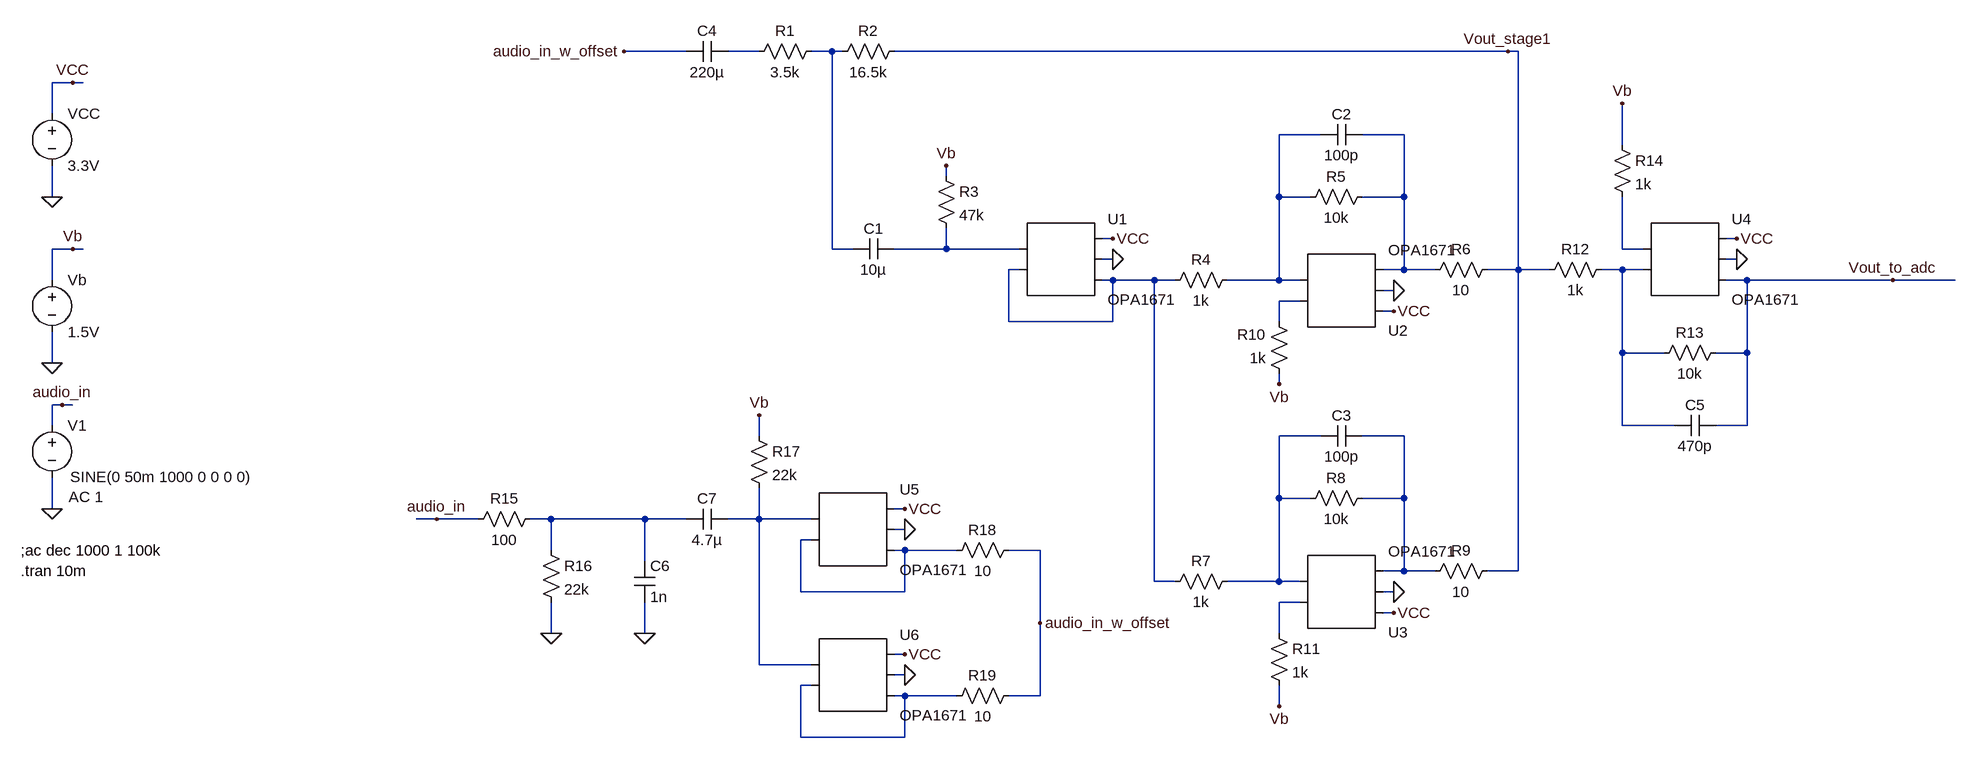
[diagram p0: schematic octaver.asc]
octaver.asc, the LTspice schematic file:
Version 4
SHEET 1 3124 1676
WIRE 144 592 48 592
WIRE 256 592 208 592
WIRE 368 592 336 592
WIRE 384 592 368 592
WIRE 1408 592 464 592
WIRE 1424 592 1408 592
WIRE -800 640 -832 640
WIRE -784 640 -800 640
WIRE -832 688 -832 640
WIRE 1120 720 1056 720
WIRE 1248 720 1184 720
WIRE 1584 736 1584 672
WIRE 544 784 544 768
WIRE -832 816 -832 768
WIRE 1056 816 1056 720
WIRE 1104 816 1056 816
WIRE 1248 816 1248 720
WIRE 1248 816 1184 816
WIRE 800 880 784 880
WIRE 1760 880 1744 880
WIRE -800 896 -832 896
WIRE -784 896 -800 896
WIRE 368 896 368 592
WIRE 400 896 368 896
WIRE 544 896 544 864
WIRE 544 896 464 896
WIRE 656 896 544 896
WIRE 1584 896 1584 816
WIRE 1616 896 1584 896
WIRE 800 912 784 912
WIRE 1760 912 1744 912
WIRE 656 928 640 928
WIRE 1248 928 1248 816
WIRE 1248 928 1216 928
WIRE 1296 928 1248 928
WIRE 1424 928 1424 592
WIRE 1424 928 1376 928
WIRE 1472 928 1424 928
WIRE 1584 928 1552 928
WIRE 1616 928 1584 928
WIRE -832 944 -832 896
WIRE 800 944 784 944
WIRE 864 944 800 944
WIRE 896 944 864 944
WIRE 1056 944 1056 816
WIRE 1056 944 976 944
WIRE 1088 944 1056 944
WIRE 1776 944 1744 944
WIRE 2000 944 1776 944
WIRE 2096 944 2000 944
WIRE 1232 960 1216 960
WIRE 1088 976 1056 976
WIRE 1232 992 1216 992
WIRE 640 1008 640 928
WIRE 800 1008 800 944
WIRE 800 1008 640 1008
WIRE 1056 1008 1056 976
WIRE 1584 1056 1584 928
WIRE 1648 1056 1584 1056
WIRE 1776 1056 1776 944
WIRE 1776 1056 1728 1056
WIRE -832 1072 -832 1024
WIRE 1056 1104 1056 1088
WIRE -816 1136 -832 1136
WIRE -800 1136 -816 1136
WIRE -832 1168 -832 1136
WIRE 1584 1168 1584 1056
WIRE 1664 1168 1584 1168
WIRE 1776 1168 1776 1056
WIRE 1776 1168 1728 1168
WIRE 256 1184 256 1152
WIRE 1120 1184 1056 1184
WIRE 1248 1184 1184 1184
WIRE 1056 1280 1056 1184
WIRE 1104 1280 1056 1280
WIRE 1248 1280 1248 1184
WIRE 1248 1280 1184 1280
WIRE -832 1296 -832 1248
WIRE 480 1296 464 1296
WIRE -240 1312 -272 1312
WIRE -176 1312 -240 1312
WIRE -64 1312 -96 1312
WIRE 80 1312 -64 1312
WIRE 144 1312 80 1312
WIRE 256 1312 256 1264
WIRE 256 1312 208 1312
WIRE 336 1312 256 1312
WIRE 480 1328 464 1328
WIRE 336 1344 320 1344
WIRE -64 1360 -64 1312
WIRE 480 1360 464 1360
WIRE 560 1360 480 1360
WIRE 688 1360 640 1360
WIRE 80 1376 80 1312
WIRE 1248 1392 1248 1280
WIRE 1248 1392 1216 1392
WIRE 1296 1392 1248 1392
WIRE 1424 1392 1424 928
WIRE 1424 1392 1376 1392
WIRE 864 1408 864 944
WIRE 896 1408 864 1408
WIRE 1056 1408 1056 1280
WIRE 1056 1408 976 1408
WIRE 1088 1408 1056 1408
WIRE 320 1424 320 1344
WIRE 480 1424 480 1360
WIRE 480 1424 320 1424
WIRE 1232 1424 1216 1424
WIRE 1088 1440 1056 1440
WIRE 1232 1456 1216 1456
WIRE 688 1472 688 1360
WIRE -64 1488 -64 1440
WIRE 80 1488 80 1440
WIRE 1056 1488 1056 1440
WIRE 480 1520 464 1520
WIRE 256 1536 256 1312
WIRE 336 1536 256 1536
WIRE 480 1552 464 1552
WIRE 336 1568 320 1568
WIRE 480 1584 464 1584
WIRE 560 1584 480 1584
WIRE 688 1584 688 1472
WIRE 688 1584 640 1584
WIRE 1056 1600 1056 1568
WIRE 320 1648 320 1568
WIRE 480 1648 480 1584
WIRE 480 1648 320 1648
FLAG -832 1296 0
FLAG -816 1136 audio_in
FLAG -832 816 0
FLAG -800 640 VCC
FLAG -832 1072 0
FLAG -800 896 Vb
FLAG 800 912 0
FLAG 800 880 VCC
FLAG 1232 960 0
FLAG 1232 992 VCC
FLAG 2000 944 Vout_to_adc
FLAG 1232 1424 0
FLAG 1232 1456 VCC
FLAG 544 768 Vb
FLAG 1056 1104 Vb
FLAG 1056 1600 Vb
FLAG 1760 912 0
FLAG 1760 880 VCC
FLAG 1584 672 Vb
FLAG 1408 592 Vout_stage1
FLAG -64 1488 0
FLAG 80 1488 0
FLAG 256 1152 Vb
FLAG 480 1328 0
FLAG 480 1296 VCC
FLAG 480 1552 0
FLAG 480 1520 VCC
FLAG -240 1312 audio_in
FLAG 688 1472 audio_in_w_offset
FLAG 48 592 audio_in_w_offset
SYMBOL voltage -832 1152 R0
WINDOW 3 28 95 Left 2
WINDOW 123 26 126 Left 2
WINDOW 39 0 0 Left 0
SYMATTR Value SINE(0 50m 1000 0 0 0 0)
SYMATTR Value2 AC 1
SYMATTR InstName V1
SYMBOL voltage -832 672 R0
WINDOW 123 0 0 Left 0
WINDOW 39 0 0 Left 0
SYMATTR InstName VCC
SYMATTR Value 3.3V
SYMBOL voltage -832 928 R0
WINDOW 123 0 0 Left 0
WINDOW 39 0 0 Left 0
SYMATTR InstName Vb
SYMATTR Value 1.5V
SYMBOL res 352 576 R90
WINDOW 0 0 56 VBottom 2
WINDOW 3 32 56 VTop 2
SYMATTR InstName R1
SYMATTR Value 3.5k
SYMBOL res 480 576 R90
WINDOW 0 0 56 VBottom 2
WINDOW 3 32 56 VTop 2
SYMATTR InstName R2
SYMATTR Value 16.5k
SYMBOL cap 464 880 R90
WINDOW 0 0 32 VBottom 2
WINDOW 3 32 32 VTop 2
SYMATTR InstName C1
SYMATTR Value 10µ
SYMBOL res 528 768 R0
SYMATTR InstName R3
SYMATTR Value 47k
SYMBOL AutoGenerated\\OPA1671 720 912 R0
SYMATTR InstName U1
SYMBOL res 992 928 R90
WINDOW 0 0 56 VBottom 2
WINDOW 3 32 56 VTop 2
SYMATTR InstName R4
SYMATTR Value 1k
SYMBOL AutoGenerated\\OPA1671 1152 960 M180
SYMATTR InstName U2
SYMBOL res 1200 800 R90
WINDOW 0 0 56 VBottom 2
WINDOW 3 32 56 VTop 2
SYMATTR InstName R5
SYMATTR Value 10k
SYMBOL cap 1184 704 R90
WINDOW 0 0 32 VBottom 2
WINDOW 3 32 32 VTop 2
SYMATTR InstName C2
SYMATTR Value 100p
SYMBOL res 1392 912 R90
WINDOW 0 0 56 VBottom 2
WINDOW 3 32 56 VTop 2
SYMATTR InstName R6
SYMATTR Value 10
SYMBOL res 992 1392 R90
WINDOW 0 0 56 VBottom 2
WINDOW 3 32 56 VTop 2
SYMATTR InstName R7
SYMATTR Value 1k
SYMBOL AutoGenerated\\OPA1671 1152 1424 M180
SYMATTR InstName U3
SYMBOL res 1200 1264 R90
WINDOW 0 0 56 VBottom 2
WINDOW 3 32 56 VTop 2
SYMATTR InstName R8
SYMATTR Value 10k
SYMBOL cap 1184 1168 R90
WINDOW 0 0 32 VBottom 2
WINDOW 3 32 32 VTop 2
SYMATTR InstName C3
SYMATTR Value 100p
SYMBOL res 1392 1376 R90
WINDOW 0 0 56 VBottom 2
WINDOW 3 32 56 VTop 2
SYMATTR InstName R9
SYMATTR Value 10
SYMBOL cap 208 576 R90
WINDOW 0 0 32 VBottom 2
WINDOW 3 32 32 VTop 2
SYMATTR InstName C4
SYMATTR Value 220µ
SYMBOL res 1072 1104 R180
WINDOW 0 36 76 Left 2
WINDOW 3 36 40 Left 2
SYMATTR InstName R10
SYMATTR Value 1k
SYMBOL res 1040 1472 R0
SYMATTR InstName R11
SYMATTR Value 1k
SYMBOL res 1568 912 R90
WINDOW 0 0 56 VBottom 2
WINDOW 3 32 56 VTop 2
SYMATTR InstName R12
SYMATTR Value 1k
SYMBOL AutoGenerated\\OPA1671 1680 912 R0
SYMATTR InstName U4
SYMBOL res 1744 1040 R90
WINDOW 0 0 56 VBottom 2
WINDOW 3 32 56 VTop 2
SYMATTR InstName R13
SYMATTR Value 10k
SYMBOL cap 1728 1152 R90
WINDOW 0 0 32 VBottom 2
WINDOW 3 32 32 VTop 2
SYMATTR InstName C5
SYMATTR Value 470p
SYMBOL res 1568 720 R0
SYMATTR InstName R14
SYMATTR Value 1k
SYMBOL res -80 1296 R90
WINDOW 0 0 56 VBottom 2
WINDOW 3 32 56 VTop 2
SYMATTR InstName R15
SYMATTR Value 100
SYMBOL res -80 1344 R0
SYMATTR InstName R16
SYMATTR Value 22k
SYMBOL cap 64 1376 R0
SYMATTR InstName C6
SYMATTR Value 1n
SYMBOL cap 208 1296 R90
WINDOW 0 0 32 VBottom 2
WINDOW 3 32 32 VTop 2
SYMATTR InstName C7
SYMATTR Value 4.7µ
SYMBOL res 240 1168 R0
SYMATTR InstName R17
SYMATTR Value 22k
SYMBOL AutoGenerated\\OPA1671 400 1328 R0
SYMATTR InstName U5
SYMBOL AutoGenerated\\OPA1671 400 1552 R0
SYMATTR InstName U6
SYMBOL res 656 1344 R90
WINDOW 0 0 56 VBottom 2
WINDOW 3 32 56 VTop 2
SYMATTR InstName R18
SYMATTR Value 10
SYMBOL res 656 1568 R90
WINDOW 0 0 56 VBottom 2
WINDOW 3 32 56 VTop 2
SYMATTR InstName R19
SYMATTR Value 10
TEXT -880 1360 Left 2 !;ac dec 1000 1 100k
TEXT -880 1392 Left 2 !.tran 10m

The netlist it stands for:
* octaver.asc
V1 audio_in 0 SINE(0 50m 1000 0 0 0 0) AC 1
VCC VCC 0 3.3V
Vb Vb 0 1.5V
R1 N002 N001 3.5k
R2 Vout_stage1 N002 16.5k
C1 N005 N002 10µ
R3 Vb N005 47k
* U1: OPA1671 (symbol AutoGenerated\OPA1671 not available, pins judged from their places): pin1=N005 pin2=N007 pin3=VCC pin4=0 pin5=N007
R4 N003 N007 1k
* U2: OPA1671 (symbol AutoGenerated\OPA1671 not available, pins judged from their places): pin1=N009 pin2=N003 pin3=VCC pin4=0 pin5=N004
R5 N004 N003 10k
C2 N004 N003 100p
R6 Vout_stage1 N004 10
R7 N010 N007 1k
* U3: OPA1671 (symbol AutoGenerated\OPA1671 not available, pins judged from their places): pin1=N015 pin2=N010 pin3=VCC pin4=0 pin5=N011
R8 N011 N010 10k
C3 N011 N010 100p
R9 Vout_stage1 N011 10
C4 N001 audio_in_w_offset 220µ
R10 Vb N009 1k
R11 N015 Vb 1k
R12 N008 Vout_stage1 1k
* U4: OPA1671 (symbol AutoGenerated\OPA1671 not available, pins judged from their places): pin1=N006 pin2=N008 pin3=VCC pin4=0 pin5=Vout_to_adc
R13 Vout_to_adc N008 10k
C5 Vout_to_adc N008 470p
R14 Vb N006 1k
R15 N012 audio_in 100
R16 N012 0 22k
C6 N012 0 1n
C7 N013 N012 4.7µ
R17 Vb N013 22k
* U5: OPA1671 (symbol AutoGenerated\OPA1671 not available, pins judged from their places): pin1=N013 pin2=N014 pin3=VCC pin4=0 pin5=N014
* U6: OPA1671 (symbol AutoGenerated\OPA1671 not available, pins judged from their places): pin1=N013 pin2=N016 pin3=VCC pin4=0 pin5=N016
R18 audio_in_w_offset N014 10
R19 audio_in_w_offset N016 10
;ac dec 1000 1 100k
.tran 10m
.backanno
.end